# Altium schematic sheet device-sagl.SchDoc
size 297 x 209 mm
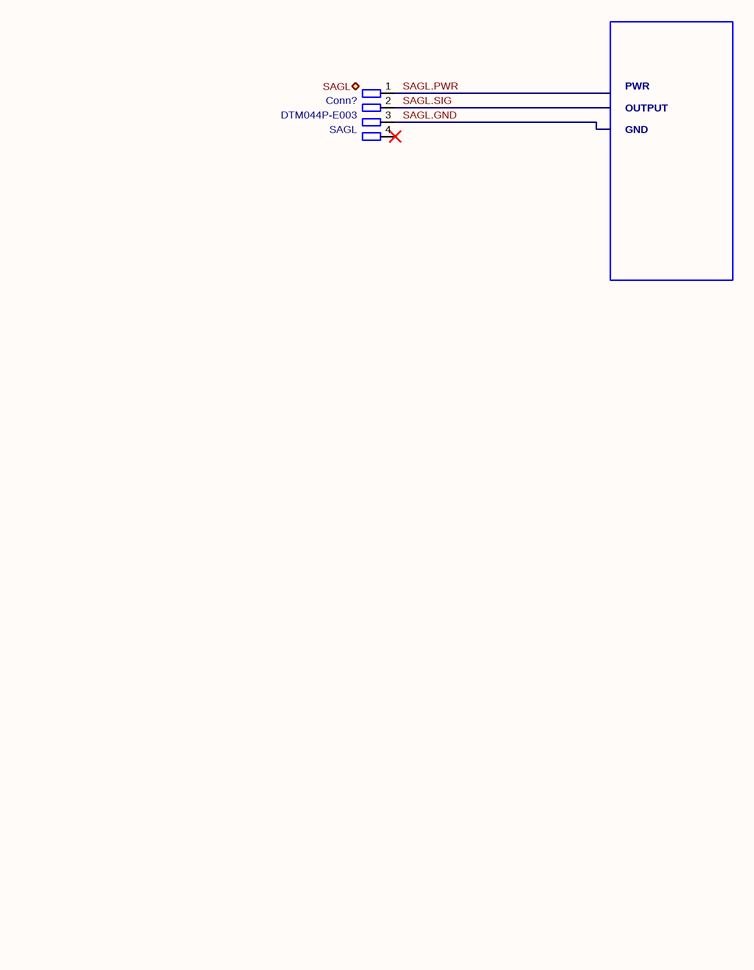
[diagram p0: device-sagl.SchDoc]

## Parts
Conn?  P/N: DTM044P-E003  Conn Name: SAGL  (hidden comment: Deutsch_DTM_4S_Pin)

## Ports
SAGL (bidir)

## Nets
SAGL.GND: Conn?.3
SAGL.PWR: Conn?.1
SAGL.SIG: Conn?.2

Not connected (* = marked no-connect by the designer): Conn? 4*

## Notes on the sheet
- OUTPUT
- PWR
- GND
- 1
- 2
- 3
- 4
- 5
- 6
- A
- B
- C
- D
- Title: DEVICE - SAGL
- File: device-sagl.kicad_sch
- Sheet: /
- KiCad E.D.A.  kicad (5.1.4)-1
- Size: A4
- Date:
- Rev:
- Id: 1/1

## Library data of the parts
Conn? = Deutsch_DTM_4P_Pin: Value: Deutsch_DTM_4S_Pin